# EAGLE design electron-power-max8606 (EAGLE 7.2.0)
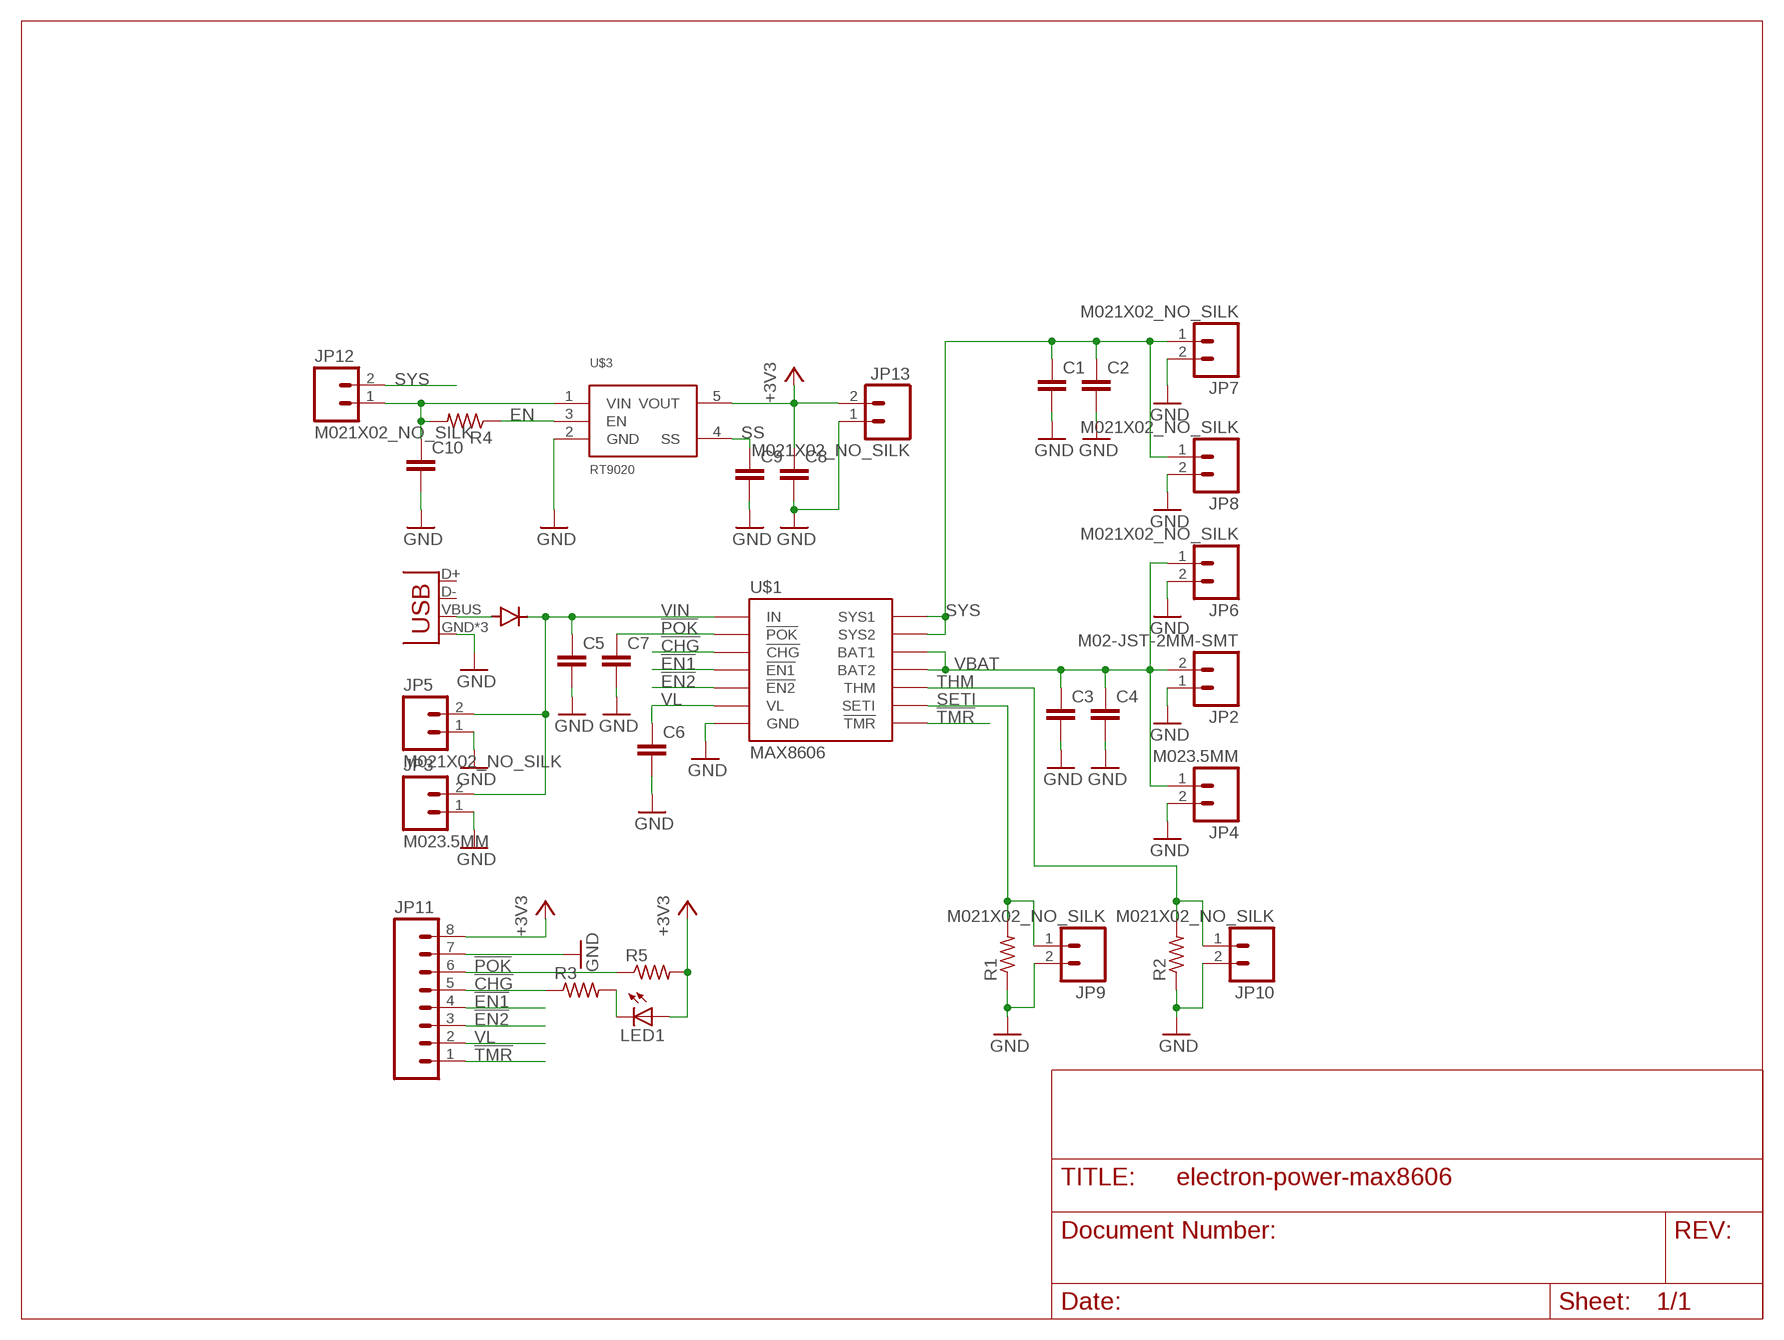
[diagram p0: schematic, sheet 1]

## Parts
C1  C-EUC0805  [C0805]
C2  C-EUC0805  [C0805]
C3  C-EUC0805  [C0805]
C4  C-EUC0805  [C0805]
C5  C-EUC0805  [C0805]
C6  C-EUC0402  [C0402]
C7  C-EUC0402  [C0402]
C8  C-EUC0402  [C0402]
C9  C-EUC0402  [C0402]
C10  C-EUC0402  [C0402]
JP1  USBUSB-MICROB-SLOT-HOLE  [USB-MICROB-SLOT-HOLE]
JP2  M02-JST-2MM-SMT  [JST-2-SMD]
JP3  M023.5MM  [SCREWTERMINAL-3.5MM-2]
JP4  M023.5MM  [SCREWTERMINAL-3.5MM-2]
JP5  M021X02_NO_SILK  [1X02_NO_SILK]
JP6  M021X02_NO_SILK  [1X02_NO_SILK]
JP7  M021X02_NO_SILK  [1X02_NO_SILK]
JP8  M021X02_NO_SILK  [1X02_NO_SILK]
JP9  M021X02_NO_SILK  [1X02_NO_SILK]
JP10  M021X02_NO_SILK  [1X02_NO_SILK]
JP11  M08  [1X08_PIN1_NO_SILK]
JP12  M021X02_NO_SILK  [1X02_NO_SILK]
JP13  M021X02_NO_SILK  [1X02_NO_SILK]
LED1  LEDSML0805  [SML0805]
R1  R-US_R0402  [R0402]
R2  R-US_R0402  [R0402]
R3  R-US_R0402  [R0402]
R4  R-US_R0402  [R0402]
R5  R-US_R0402  [R0402]
U$1  MAX8606  [TDFN-14]
U$2  DIODE  [DIODE-DO-220AA(SMP)]
U$3  RT9020  [SOT23-5]

## Nets
!CHG: JP11.5 R3.1 U$1.P$6(!CHG)
!EN1: JP11.4 U$1.P$10(!EN1)
!EN2: JP11.3 U$1.P$9(!EN2)
!POK: C7.1 JP11.6 R5.1 U$1.P$7(!POK)
!TMR: JP11.1 U$1.P$8(!TMR)
+3V3: C8.1 JP11.8 JP13.2 LED1.A R5.2 U$3.5(VOUT)
EN: R4.1 U$3.3(EN)
GND: C1.2 C2.2 C3.2 C4.2 C5.2 C6.2 C7.2 C8.2 C9.2 C10.2 JP1.GND JP1.MT1(GND) JP1.MT2(GND) JP2.1 JP3.1 JP4.2 JP5.1 JP6.2 JP7.2 JP8.2 JP9.2 JP10.2 JP11.7 JP13.1 R1.1 R2.1 U$1.P$11(GND) U$3.2(GND)
N$1: JP1.VBUS U$2.ANODE
N$2: C10.1 JP12.1 R4.2 U$3.1(VIN)
N$3: LED1.C R3.2
SETI: JP9.1 R1.2 U$1.P$12(SETI)
SS: C9.1 U$3.4(SS)
SYS: C1.1 C2.1 JP7.1 JP8.1 JP12.2 U$1.P$13(SYS1) U$1.P$14(SYS2)
THM: JP10.1 R2.2 U$1.P$5(THM)
VBAT: C3.1 C4.1 JP2.2 JP4.1 JP6.1 U$1.P$1(BAT1) U$1.P$2(BAT2)
VIN: C5.1 JP3.2 JP5.2 U$1.P$3(IN) U$2.CATHODE
VL: C6.1 JP11.2 U$1.P$4(VL)
Unconnected: JP1.D+ JP1.D- U$1.P$15(TPAD)

## Library data of the parts
C1-C10 = rcl:C-EU: CAPACITOR, European symbol
JP1 = Spark:USB
JP2 = SparkFun-Connectors:M02: Standard 2-pin 0.1" header. Use with - straight break away headers ( PRT-00116) - right angle break away headers (PRT-00553) - swiss pins (PRT-00743) - machine pins (PRT-00117) - female headers (PRT-00115) Molex polarized connector foot print use with: PRT-08233 with associated crimp pins and housings. 2.54_SCREWTERM for use with PRT-10571. 3.5mm Screw Terminal footprints for PRT-08084 5mm Screw Terminal footprints for use with PRT-08433; PROD_ID: CONN-08352
JP3-JP10 JP12 JP13 = SparkFun-Connectors:M02: Standard 2-pin 0.1" header. Use with - straight break away headers ( PRT-00116) - right angle break away headers (PRT-00553) - swiss pins (PRT-00743) - machine pins (PRT-00117) - female headers (PRT-00115) Molex polarized connector foot print use with: PRT-08233 with associated crimp pins and housings. 2.54_SCREWTERM for use with PRT-10571. 3.5mm Screw Terminal footprints for PRT-08084 5mm Screw Terminal footprints for use with PRT-08433
JP11 = SparkFun-Connectors:M08: Header 8 Standard 8-pin 0.1" header. Use with straight break away headers (SKU : PRT-00116), right angle break away headers (PRT-00553), swiss pins (PRT-00743), machine pins (PRT-00117), and female headers (PRT-00115).
LED1 = led:LED: LED OSRAM: - CHIPLED LG R971, LG N971, LY N971, LG Q971, LY Q971, LO R971, LY R971 LH N974, LH R974 LS Q976, LO Q976, LY Q976 LO Q996 - Hyper CHIPLED LW Q18S LB Q993, LB Q99A, LB R99A - SideLED LS A670, LO A670, LY A670, LG A670, LP A670 LB A673, LV A673, LT A673, LW A673 LH A674 LY A675 LS A676, LA A676, LO A676, LY A676, LW A676 LS A679, LY A679, LG A679 - Hyper Micro SIDELED® LS Y876, LA Y876, LO Y876, LY Y876 LT Y87S - SmartLED LW L88C, LW L88S LB L89C, LB L89S, LG L890 LS L89K, LO L89K, LY L89K LS L896, LA L896, LO L896, LY L896 - TOPLED LS T670, LO T670, LY T670, LG T670, LP T670 LSG T670, LSP T670, LSY T670, LOP T670, LYG T670 LG T671, LOG T671, LSG T671 LB T673, LV T673, LT T673, LW T673 LH T674 LS T676, LA T676, LO T676, LY T676, LB T676, LH T676, LSB T676, LW T676 LB T67C, LV T67C, LT T67C, LS T67K, LO T67K, LY T67K, LW E67C LS E67B, LA E67B, LO E67B, LY E67B, LB E67C, LV E67C, LT E67C LW T67C LS T679, LY T679, LG T679 LS T770, LO T770, LY T770, LG T770, LP T770 LB T773, LV T773, LT T773, LW T773 LH T774 LS E675, LA E675, LY E675, LS T675 LS T776, LA T776, LO T776, LY T776, LB T776 LHGB T686 LT T68C, LB T68C - Hyper Mini TOPLED® LB M676 - Mini TOPLED Santana® LG M470 LS M47K, LO M47K, LY M47K Source: http://www.osram.convergy.de LUXEON: - LUMILED® LXK2-PW12-R00, LXK2-PW12-S00, LXK2-PW14-U00, LXK2-PW14-V00 LXK2-PM12-R00, LXK2-PM12-S00, LXK2-PM14-U00 LXK2-PE12-Q00, LXK2-PE12-R00, LXK2-PE12-S00, LXK2-PE14-T00, LXK2-PE14-U00 LXK2-PB12-K00, LXK2-PB12-L00, LXK2-PB12-M00, LXK2-PB14-N00, LXK2-PB14-P00, LXK2-PB14-Q00 LXK2-PR12-L00, LXK2-PR12-M00, LXK2-PR14-Q00, LXK2-PR14-R00 LXK2-PD12-Q00, LXK2-PD12-R00, LXK2-PD12-S00 LXK2-PH12-R00, LXK2-PH12-S00 LXK2-PL12-P00, LXK2-PL12-Q00, LXK2-PL12-R00 Source: www.luxeon.com KINGBRIGHT: KA-3528ASYC Source: www.kingbright.com
R1-R5 = rcl:R-US_: RESISTOR, American symbol
U$1 = maxim:MAX8606
U$2 = Spark:DIODE
U$3 = electron:RT9020

## Board
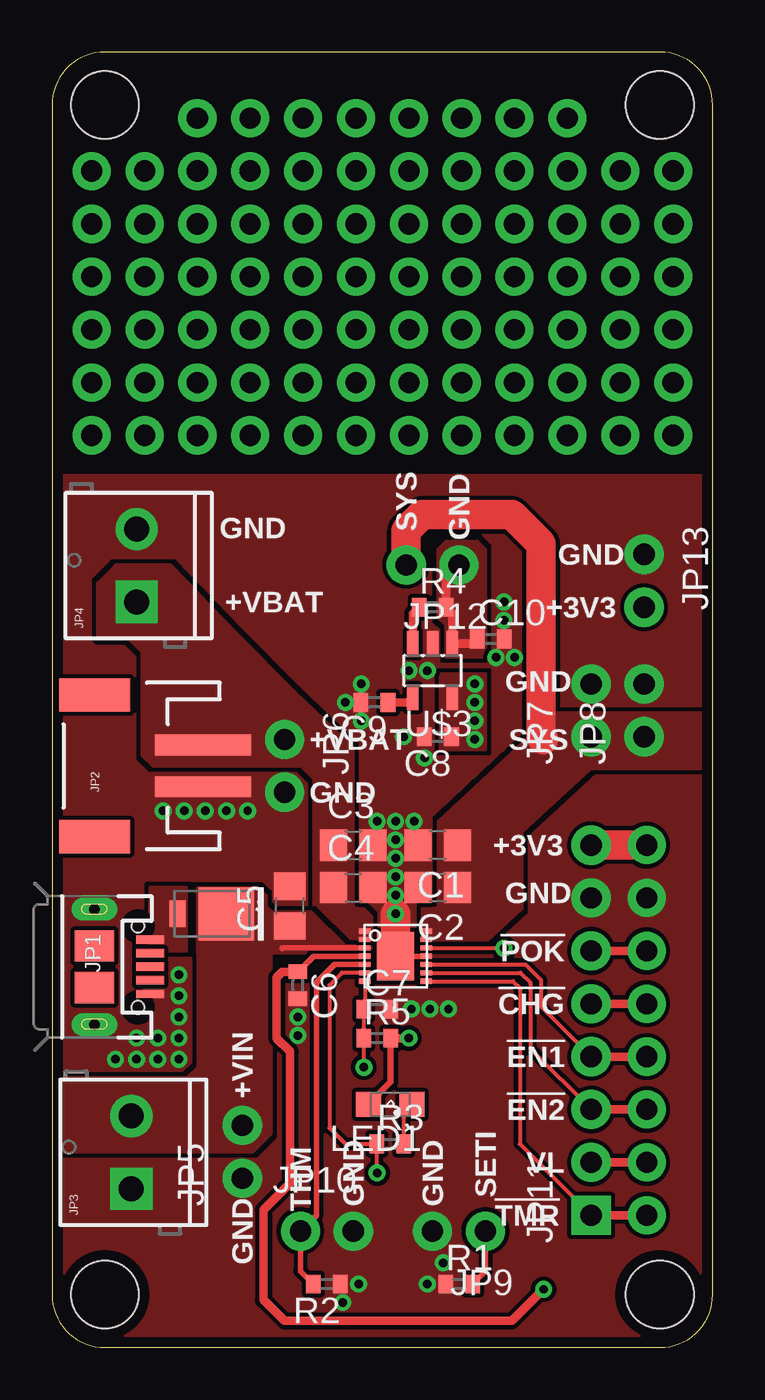
[diagram p1: board, top side]
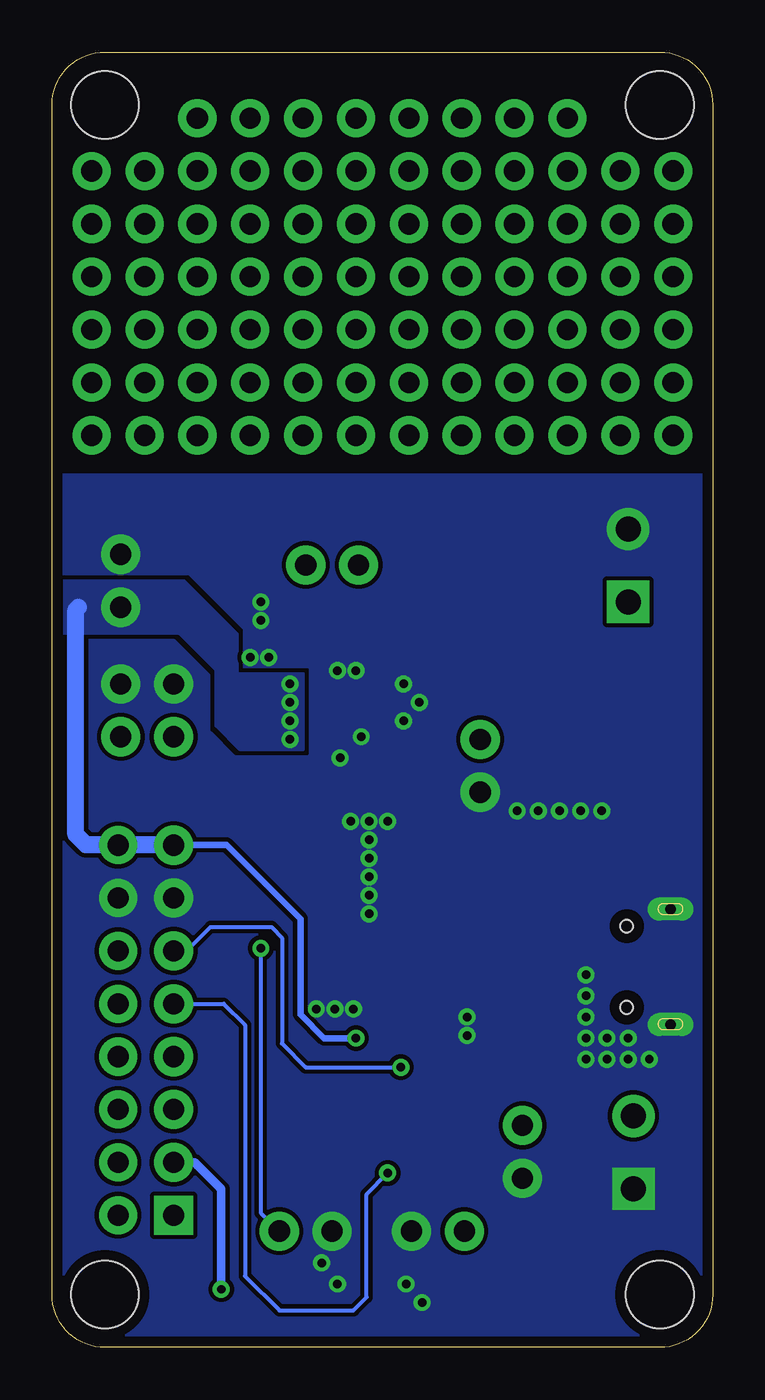
[diagram p2: board, bottom side, seen from below]

Size 31.75 x 62.23 mm. Coordinates in mm from the lower left corner, seen from the top.
Outline: 2.54,0 29.21,0 arc90 31.75,2.54 31.75,59.69 arc90 29.21,62.23 2.54,62.23 arc90 0,59.69 0,2.54 arc90 2.54,0
Copper layers (1*16): Top 0.035mm / dielectric 1.5mm / Bottom 0.035mm
Design rules "default *": minimum track width 8mil, minimum drill 12mil, track to track 8mil, track to pad 8mil, pad to pad 8mil, via to via 8mil, smd to smd 2mil, copper to edge 20mil, drill to drill 8mil, minimum pad ring 8mil, minimum via ring 8mil, stop-mask expansion 4mil, vias tented up to drill 23mil, thermal gap 10mil
Holes 3.25 mm at 2.54,2.54 29.21,2.54 2.54,59.69 29.21,59.69

### Footprints (pad centres in the part's own frame; a part is rotated, then mirrored left to right if it is on the bottom)
C0805 = smd 1.3 x 1.5: 1 -0.95,0; 2 0.95,0
C0402 = smd 0.7 x 0.9: 1 -0.65,0; 2 0.65,0
USB-MICROB-SLOT-HOLE = smd 0.4 x 1.35: D+ 0,2.675; D- -0.65,2.675; GND 1.3,2.675; ID 0.65,2.675; VBUS -1.3,2.675 | drill 0.5 pad 1.1 long: MT1 -2.775,0; MT2 2.775,0 | smd 1.5 x 1.9: P$1 -1,0; P$2 1,0.01 | hole 0.6: -1.95,2.1; 1.95,2.1
JST-2-SMD = smd 1 x 4.6: 1 -1,-3.7; 2 1,-3.7 | smd 1.6 x 3.4: NC1 -3.4,1.5; NC2 3.4,1.5
SCREWTERMINAL-3.5MM-2 = drill 1.2 pad 2.032 square: 1 0,0 | drill 1.2 pad 2.032: 2 3.5,0
1X02_NO_SILK = drill 1.016 pad 1.88: 1 0,0; 2 2.54,0
1X08_PIN1_NO_SILK = drill 1.016 pad 1.88 square: 1 0,0 | drill 1.016 pad 1.88: 2 2.54,0; 3 5.08,0; 4 7.62,0; 5 10.16,0; 6 12.7,0; 7 15.24,0; 8 17.78,0
SML0805 = smd 1.2 x 1.2: A 1.05,0; C -1.05,0
R0402 = smd 0.7 x 0.9: 1 -0.65,0; 2 0.65,0
TDFN-14 = smd 0.56 x 0.25: P$1 -1.475,1.2; P$2 -1.475,0.8; P$3 -1.475,0.4; P$4 -1.475,0; P$5 -1.475,-0.4; P$6 -1.475,-0.8; P$7 -1.475,-1.2; P$8 1.475,-1.2; P$9 1.475,-0.8; P$10 1.475,-0.4; P$11 1.475,0; P$12 1.475,0.4; P$13 1.475,0.8; P$14 1.475,1.2 | smd 1.78 x 2.35: P$15 0,0
DIODE-DO-220AA(SMP) = smd 0.762 x 1.27: ANODE 2.349,0 | smd 2.667 x 2.54: CATHODE 0,0
SOT23-5 = smd 0.55 x 1.2: 1 -0.95,-1.3; 2 0,-1.3; 3 0.95,-1.3; 4 0.95,1.3; 5 -0.95,1.3

### Placement (x,y rotation side)
C1  18.54,24.13 180 top
C2  18.54,22.1 180 top
C3  14.48,24.13 0 top
C4  14.48,22.1 0 top
C5  11.43,21.21 90 top
C6  11.81,17.4 270 top
C7  15.62,16.26 0 top
C8  18.54,29.34 180 top
C9  15.49,30.99 180 top
C10  21.08,34.04 0 top
JP1  2.03,18.29 270 top
JP2  3.56,27.94 90 top
JP3  3.81,7.62 90 top
JP4  4.06,35.81 90 top
JP5  9.14,8.13 90 top
JP6  11.18,29.21 270 top
JP7  25.91,29.34 90 top
JP8  28.45,29.34 90 top
JP9  20.83,5.59 180 top
JP10  11.94,5.59 0 top
JP11  25.91,6.35 90 top
JP12  19.56,37.59 180 top
JP13  28.45,38.1 270 top
LED1  16.26,11.68 180 top
R1  19.56,3.05 0 top
R2  13.21,3.05 180 top
R3  16.26,9.78 0 top
R4  18.29,35.56 0 top
R5  15.62,14.86 0 top
U$1  16.51,18.8 0 top
U$2  8.38,20.83 180 top
U$3  18.29,32.51 180 top

### Tracks (layer width: path | path; a pad name or v marks a point on that pad's centre or on a via)
!CHG  (via drill 0.41, 1.02 pad 1.83)
  Top 0.203: U$1.P$6 13.93,18 13.34,17.4 13.34,10.54 14.1,9.78 R3.1 15.62,9.76 v15.62,8.38
  Top 0.406: v28.57,16.51 JP11.5
  Bottom 0.203: JP11.5 23.5,16.51 22.48,15.49 22.48,3.43 20.83,1.78 17.27,1.78 16.64,2.41 16.64,7.37 v15.62,8.38
!EN1  (via drill 1.02 pad 1.83)
  Top 0.203: U$1.P$10 22.75,18.4 23.5,17.65 23.5,16.38 JP11.4
  Top 0.406: v28.57,13.97 JP11.4
!EN2  (via drill 1.02 pad 1.83)
  Top 0.203: U$1.P$9 22.52,18 22.99,17.53 22.99,14.35 JP11.3
  Top 0.406: v28.57,11.43 JP11.3
!POK  (via drill 0.41, 1.02 pad 1.83)
  Top 0.203: U$1.P$7 15.04,16.32 C7.1 R5.1 14.99,14.84 v14.99,13.46
  Top 0.406: v28.57,19.05 JP11.6
  Bottom 0.203: JP11.6 25.27,19.05 24.13,20.19 21.21,20.19 20.7,19.68 20.7,14.61 19.56,13.46 v14.99,13.46
!TMR  (via drill 1.02 pad 1.83)
  Top 0.203: U$1.P$8 22.16,17.6 22.48,17.27 22.48,9.78 JP11.1
  Top 0.406: v28.57,6.35 JP11.1
+3V3  (via drill 0.41, 1.02 pad 1.83)
  Top 0.305: R5.2 16.27,12.75 LED1.A
  Top 0.406: R5.2 v17.14,14.86
  Top 1.422: v28.57,24.13 JP11.8
  Bottom 0.305: v17.14,14.86 18.67,14.86 19.81,16 19.81,20.59 23.37,24.14 25.89,24.14 JP11.8
  Bottom 0.813: 25.89,24.14 30.11,24.14 30.61,24.64 30.61,35.43 30.48,35.56
  other vias: 20.32,30.99 20.32,30.1 20.32,29.21 20.32,31.88
  pour Top (no thermals): 18.67,32.38 20.83,32.38 20.83,28.7 18.67,28.7
  pour Bottom (no thermals): 19.68,28.7 22.73,28.7 23.88,29.84 23.88,32.51 25.65,34.29 31.24,34.29 31.24,36.83 25.4,36.83 22.86,34.29 22.86,32.38 19.68,32.38
EN
  Top 0.406: U$3.3 17.34,35.26 R4.1
GND  (via drill 0.41, 1.02 pad 1.83)
  Top 0.254: U$1.P$11 16.51,18.8
  Top 1.422: 16.51,18.8 v16.51,20.83
  other vias: 16.89,29.34 17.91,28.32 14.86,30.1 14.1,30.99 14.86,31.88 18.03,32.51 17.14,32.51 21.72,34.92 21.34,33.15 21.72,35.81 22.23,33.15 11.81,15.88 11.81,14.99 14.73,3.05 13.97,2.16 18.03,3.05 6.1,16.89 6.1,17.91 6.1,15.88 6.1,14.86 6.1,13.84 5.08,13.84 4.06,13.84 3.05,13.84 5.08,14.86 4.06,14.86 5.33,25.78 6.35,25.78 7.37,25.78 8.38,25.78 9.4,25.78 17.27,16.26 18.16,16.26 19.05,16.26 16.51,21.72 16.51,22.61 16.51,23.5 16.51,24.38 16.51,25.27 17.4,25.27 15.62,25.27 18.8,4.06 28.57,21.59
  pour Top (rank 3, no thermals): 0,0 0,41.91 31.75,41.91 31.75,0
  pour Bottom (rank 3, no thermals): 0,0 0,41.91 31.75,41.91 31.75,0
N$1
  pour Top (no thermals): 4.7,19.05 6.48,19.05 6.48,22.1 4.7,22.1
N$2
  Top 0.406: C10.1 20.21,33.81 U$3.1 19.24,35.26 R4.2 18.94,36.97 JP12.1
  pour Top (no thermals): 18.92,33.15 18.92,34.67 18.54,35.05 18.54,38.35 18.92,38.73 20.45,38.73 20.83,38.35 20.83,33.15
N$3
  Top 0.203: R3.2 16.91,11.28 LED1.C
N$4  (via drill 1.02 pad 1.83)
  other vias: 1.91,43.81
N$5  (via drill 1.02 pad 1.83)
  other vias: 4.45,43.81
N$6  (via drill 1.02 pad 1.83)
  other vias: 6.99,43.81
N$7  (via drill 1.02 pad 1.83)
  other vias: 9.53,43.81
N$8  (via drill 1.02 pad 1.83)
  other vias: 12.06,43.81
N$9  (via drill 1.02 pad 1.83)
  other vias: 14.61,43.81
N$10  (via drill 1.02 pad 1.83)
  other vias: 17.14,43.81
N$11  (via drill 1.02 pad 1.83)
  other vias: 19.68,43.81
N$12  (via drill 1.02 pad 1.83)
  other vias: 22.23,43.81
N$13  (via drill 1.02 pad 1.83)
  other vias: 24.77,43.81
N$14  (via drill 1.02 pad 1.83)
  other vias: 27.3,43.81
N$15  (via drill 1.02 pad 1.83)
  other vias: 29.84,43.81
N$16  (via drill 1.02 pad 1.83)
  other vias: 1.91,46.35
N$17  (via drill 1.02 pad 1.83)
  other vias: 4.45,46.35
N$18  (via drill 1.02 pad 1.83)
  other vias: 6.99,46.35
N$19  (via drill 1.02 pad 1.83)
  other vias: 9.53,46.35
N$20  (via drill 1.02 pad 1.83)
  other vias: 12.06,46.35
N$21  (via drill 1.02 pad 1.83)
  other vias: 14.61,46.35
N$22  (via drill 1.02 pad 1.83)
  other vias: 17.14,46.35
N$23  (via drill 1.02 pad 1.83)
  other vias: 19.68,46.35
N$24  (via drill 1.02 pad 1.83)
  other vias: 22.23,46.35
N$25  (via drill 1.02 pad 1.83)
  other vias: 24.77,46.35
N$26  (via drill 1.02 pad 1.83)
  other vias: 27.3,46.35
N$27  (via drill 1.02 pad 1.83)
  other vias: 29.84,46.35
N$28  (via drill 1.02 pad 1.83)
  other vias: 29.84,48.9
N$29  (via drill 1.02 pad 1.83)
  other vias: 27.3,48.9
N$30  (via drill 1.02 pad 1.83)
  other vias: 24.77,48.9
N$31  (via drill 1.02 pad 1.83)
  other vias: 22.23,48.9
N$32  (via drill 1.02 pad 1.83)
  other vias: 19.68,48.9
N$33  (via drill 1.02 pad 1.83)
  other vias: 17.14,48.9
N$34  (via drill 1.02 pad 1.83)
  other vias: 14.61,48.9
N$35  (via drill 1.02 pad 1.83)
  other vias: 12.06,48.9
N$36  (via drill 1.02 pad 1.83)
  other vias: 9.53,48.9
N$37  (via drill 1.02 pad 1.83)
  other vias: 6.99,48.9
N$38  (via drill 1.02 pad 1.83)
  other vias: 4.45,48.9
N$39  (via drill 1.02 pad 1.83)
  other vias: 1.91,48.9
N$40  (via drill 1.02 pad 1.83)
  other vias: 1.91,51.44
N$41  (via drill 1.02 pad 1.83)
  other vias: 4.45,51.44
N$42  (via drill 1.02 pad 1.83)
  other vias: 6.99,51.44
N$43  (via drill 1.02 pad 1.83)
  other vias: 9.53,51.44
N$44  (via drill 1.02 pad 1.83)
  other vias: 12.06,51.44
N$45  (via drill 1.02 pad 1.83)
  other vias: 14.61,51.44
N$46  (via drill 1.02 pad 1.83)
  other vias: 17.14,51.44
N$47  (via drill 1.02 pad 1.83)
  other vias: 19.68,51.44
N$48  (via drill 1.02 pad 1.83)
  other vias: 22.23,51.44
N$49  (via drill 1.02 pad 1.83)
  other vias: 24.77,51.44
N$50  (via drill 1.02 pad 1.83)
  other vias: 27.3,51.44
N$51  (via drill 1.02 pad 1.83)
  other vias: 29.84,51.44
N$52  (via drill 1.02 pad 1.83)
  other vias: 29.84,53.98
N$53  (via drill 1.02 pad 1.83)
  other vias: 27.3,53.98
N$54  (via drill 1.02 pad 1.83)
  other vias: 24.77,53.98
N$55  (via drill 1.02 pad 1.83)
  other vias: 22.23,53.98
N$56  (via drill 1.02 pad 1.83)
  other vias: 19.68,53.98
N$57  (via drill 1.02 pad 1.83)
  other vias: 17.14,53.98
N$58  (via drill 1.02 pad 1.83)
  other vias: 14.61,53.98
N$59  (via drill 1.02 pad 1.83)
  other vias: 12.06,53.98
N$60  (via drill 1.02 pad 1.83)
  other vias: 9.53,53.98
N$61  (via drill 1.02 pad 1.83)
  other vias: 6.99,53.98
N$62  (via drill 1.02 pad 1.83)
  other vias: 4.45,53.98
N$63  (via drill 1.02 pad 1.83)
  other vias: 1.91,53.98
N$64  (via drill 1.02 pad 1.83)
  other vias: 1.91,56.52
N$65  (via drill 1.02 pad 1.83)
  other vias: 4.45,56.52
N$66  (via drill 1.02 pad 1.83)
  other vias: 6.99,56.52
N$67  (via drill 1.02 pad 1.83)
  other vias: 9.53,56.52
N$68  (via drill 1.02 pad 1.83)
  other vias: 12.06,56.52
N$69  (via drill 1.02 pad 1.83)
  other vias: 14.61,56.52
N$70  (via drill 1.02 pad 1.83)
  other vias: 17.14,56.52
N$71  (via drill 1.02 pad 1.83)
  other vias: 19.68,56.52
N$72  (via drill 1.02 pad 1.83)
  other vias: 22.23,56.52
N$73  (via drill 1.02 pad 1.83)
  other vias: 24.77,56.52
N$74  (via drill 1.02 pad 1.83)
  other vias: 27.3,56.52
N$75  (via drill 1.02 pad 1.83)
  other vias: 29.84,56.52
N$76  (via drill 1.02 pad 1.83)
  other vias: 6.99,59.05
N$77  (via drill 1.02 pad 1.83)
  other vias: 9.53,59.05
N$78  (via drill 1.02 pad 1.83)
  other vias: 12.06,59.05
N$79  (via drill 1.02 pad 1.83)
  other vias: 14.61,59.05
N$80  (via drill 1.02 pad 1.83)
  other vias: 17.14,59.05
N$81  (via drill 1.02 pad 1.83)
  other vias: 19.68,59.05
N$82  (via drill 1.02 pad 1.83)
  other vias: 22.23,59.05
N$83  (via drill 1.02 pad 1.83)
  other vias: 24.77,59.05
SETI  (via drill 0.41)
  Top 0.203: U$1.P$12 21.7,19.2 v21.72,19.18
  Top 0.254: JP9.1 20.83,3.67 R1.2
  Bottom 0.203: v21.72,19.18 21.72,6.48 JP9.1
SS
  Top 0.406: C9.1 17.11,30.99 U$3.4
SYS
  Top 1.422: JP12.2 17.02,39.24 17.78,40.01 22.1,40.01 23.5,38.61 23.5,29.34 23.62,29.21
  pour Top (no thermals): 17.78,19.56 20.95,19.56 22.61,21.08 22.61,24.77 25.91,27.81 31.62,27.81 31.62,30.48 24.13,30.48 18.54,25.27 18.54,21.08 17.78,21.08
THM
  Top 0.254: U$1.P$5 13.57,18.4 12.7,17.53 12.7,6.35 JP10.1 11.94,3.67 R2.2
VBAT
  pour Top (rank 2, no thermals): 15.37,19.43 15.37,20.7 14.99,21.08 14.61,21.08 14.48,21.21 14.48,28.83 11.68,31.5 8.89,34.29 5.71,37.59 3.05,37.59 2.16,36.7 2.16,34.16 2.29,34.04 3.68,34.04 4.32,33.4 4.32,28.45 4.83,27.94 11.94,27.94 12.57,27.3 12.57,21.21 14.35,19.43
VIN
  Top 0.254: U$1.P$3 11.07,19.2 11.05,19.18
  pour Top (no thermals): 15.37,19.3 15.37,18.92 6.99,18.92 6.99,22.1 9.91,22.1 10.29,21.72 10.29,21.21 10.54,20.95 12.45,20.95 14.1,19.3
  pour Top (no thermals): 0.38,9.4 9.65,9.4 10.54,10.29 10.54,19.18 6.99,19.18 6.99,13.46 6.48,12.95 0.38,12.95
VL  (via drill 0.41, 1.02 pad 1.83)
  Top 0.254: U$1.P$4 12.56,18.8 C6.1
  Top 0.406: C6.1 11.06,18.05 10.79,17.78 10.79,14.86 11.43,14.22 11.43,7.87 10.16,6.6 10.16,2.29 11.18,1.27 22.1,1.27 v23.62,2.79 | v28.57,8.89 JP11.2
  Bottom 0.406: JP11.2 24.89,8.89 23.62,7.62 v23.62,2.79

### Text on the board
tPlace: SYS | GND | GND | GND | +VBAT | +3V3 | GND | +VBAT | SYS | GND | +3V3 | GND | !POK | !CHG | !EN1 | +VIN | !EN2 | THM | SETI | VL | GND | GND | GND | !TMR